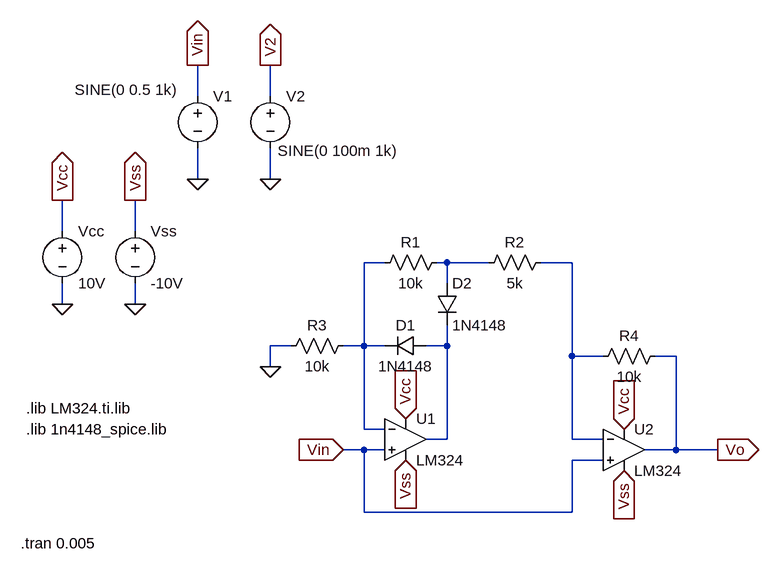
[diagram p0: schematic Circuito3.asc]
Circuito3.asc, the LTspice schematic file:
Version 4.1
SHEET 1 880 680
WIRE -336 -320 -336 -368
WIRE -224 -320 -224 -368
WIRE -336 -192 -336 -240
WIRE -224 -192 -224 -240
WIRE -544 -112 -544 -160
WIRE -432 -112 -432 -160
WIRE -48 -64 -80 -64
WIRE 48 -64 32 -64
WIRE 112 -64 48 -64
WIRE 240 -64 192 -64
WIRE 48 -32 48 -64
WIRE -544 0 -544 -32
WIRE -432 0 -432 -32
WIRE -192 64 -224 64
WIRE -80 64 -80 -64
WIRE -80 64 -112 64
WIRE -48 64 -80 64
WIRE 48 64 48 32
WIRE 48 64 16 64
WIRE 240 80 240 -64
WIRE 288 80 240 80
WIRE 400 80 368 80
WIRE -224 96 -224 64
WIRE -80 192 -80 64
WIRE -48 192 -80 192
WIRE 48 208 48 64
WIRE 48 208 16 208
WIRE 240 208 240 80
WIRE 288 208 240 208
WIRE -80 224 -112 224
WIRE -48 224 -80 224
WIRE 400 224 400 80
WIRE 400 224 352 224
WIRE 464 224 400 224
WIRE 288 240 240 240
WIRE -80 320 -80 224
WIRE 240 320 240 240
WIRE 240 320 -80 320
FLAG -112 224 Vin
IOPIN -112 224 In
FLAG -16 176 Vcc
IOPIN -16 176 In
FLAG 320 192 Vcc
IOPIN 320 192 In
FLAG 320 256 Vss
IOPIN 320 256 In
FLAG -16 240 Vss
IOPIN -16 240 In
FLAG 464 224 Vo
IOPIN 464 224 Out
FLAG -224 96 0
FLAG -544 0 0
FLAG -432 0 0
FLAG -544 -160 Vcc
IOPIN -544 -160 Out
FLAG -432 -160 Vss
IOPIN -432 -160 Out
FLAG -336 -368 Vin
IOPIN -336 -368 Out
FLAG -224 -368 V2
IOPIN -224 -368 Out
FLAG -336 -192 0
FLAG -224 -192 0
SYMBOL OpAmps\\opamp2 -16 144 R0
SYMATTR InstName U1
SYMATTR Value LM324
SYMBOL res 48 -80 R90
WINDOW 0 0 56 VBottom 2
WINDOW 3 32 56 VTop 2
SYMATTR InstName R1
SYMATTR Value 10k
SYMATTR SpiceLine tol=1
SYMBOL res 208 -80 R90
WINDOW 0 0 56 VBottom 2
WINDOW 3 32 56 VTop 2
SYMATTR InstName R2
SYMATTR Value 5k
SYMATTR SpiceLine tol=1
SYMBOL res -96 48 R90
WINDOW 0 0 56 VBottom 2
WINDOW 3 32 56 VTop 2
SYMATTR InstName R3
SYMATTR Value 10k
SYMATTR SpiceLine tol=1
SYMBOL res 384 64 R90
WINDOW 0 0 56 VBottom 2
WINDOW 3 32 56 VTop 2
SYMATTR InstName R4
SYMATTR Value 10k
SYMATTR SpiceLine tol=1
SYMBOL OpAmps\\opamp2 320 160 R0
SYMATTR InstName U2
SYMATTR Value LM324
SYMBOL voltage -544 -128 R0
SYMATTR InstName Vcc
SYMATTR Value 10V
SYMBOL voltage -432 -128 R0
SYMATTR InstName Vss
SYMATTR Value -10V
SYMBOL voltage -336 -336 R0
WINDOW 3 -189 6 Left 2
WINDOW 123 0 0 Left 0
WINDOW 39 0 0 Left 0
SYMATTR Value SINE(0 0.5 1k)
SYMATTR InstName V1
SYMBOL voltage -224 -336 R0
WINDOW 3 11 100 Left 2
WINDOW 123 0 0 Left 0
WINDOW 39 0 0 Left 0
SYMATTR Value SINE(0 100m 1k)
SYMATTR InstName V2
SYMBOL diode 16 48 R90
WINDOW 0 0 32 VBottom 2
WINDOW 3 32 32 VTop 2
SYMATTR InstName D1
SYMATTR Value 1N4148
SYMBOL diode 32 -32 R0
SYMATTR InstName D2
SYMATTR Value 1N4148
TEXT -600 160 Left 2 !.lib LM324.ti.lib
TEXT -608 368 Left 2 !.tran 0.005
TEXT -600 192 Left 2 !.lib 1n4148_spice.lib

The netlist it stands for:
* Circuito3.asc
X§U1 Vin N001 Vcc Vss N004 LM324  ; pins In+ In- V+ V- OUT
R1 N002 N001 10k tol=1
R2 N003 N002 5k tol=1
R3 N001 0 10k tol=1
R4 Vo N003 10k tol=1
X§U2 Vin N003 Vcc Vss Vo LM324  ; pins In+ In- V+ V- OUT
Vcc Vcc 0 10V
Vss Vss 0 -10V
V1 Vin 0 SINE(0 0.5 1k)
V2 V2 0 SINE(0 100m 1k)
D1 N004 N001 1N4148
D2 N002 N004 1N4148
.model D D
.lib standard.dio
.lib LM324.ti.lib
.tran 0.005
.lib 1n4148_spice.lib
.backanno
.end